# Altium schematic sheet FAT32.SchDoc
size A4
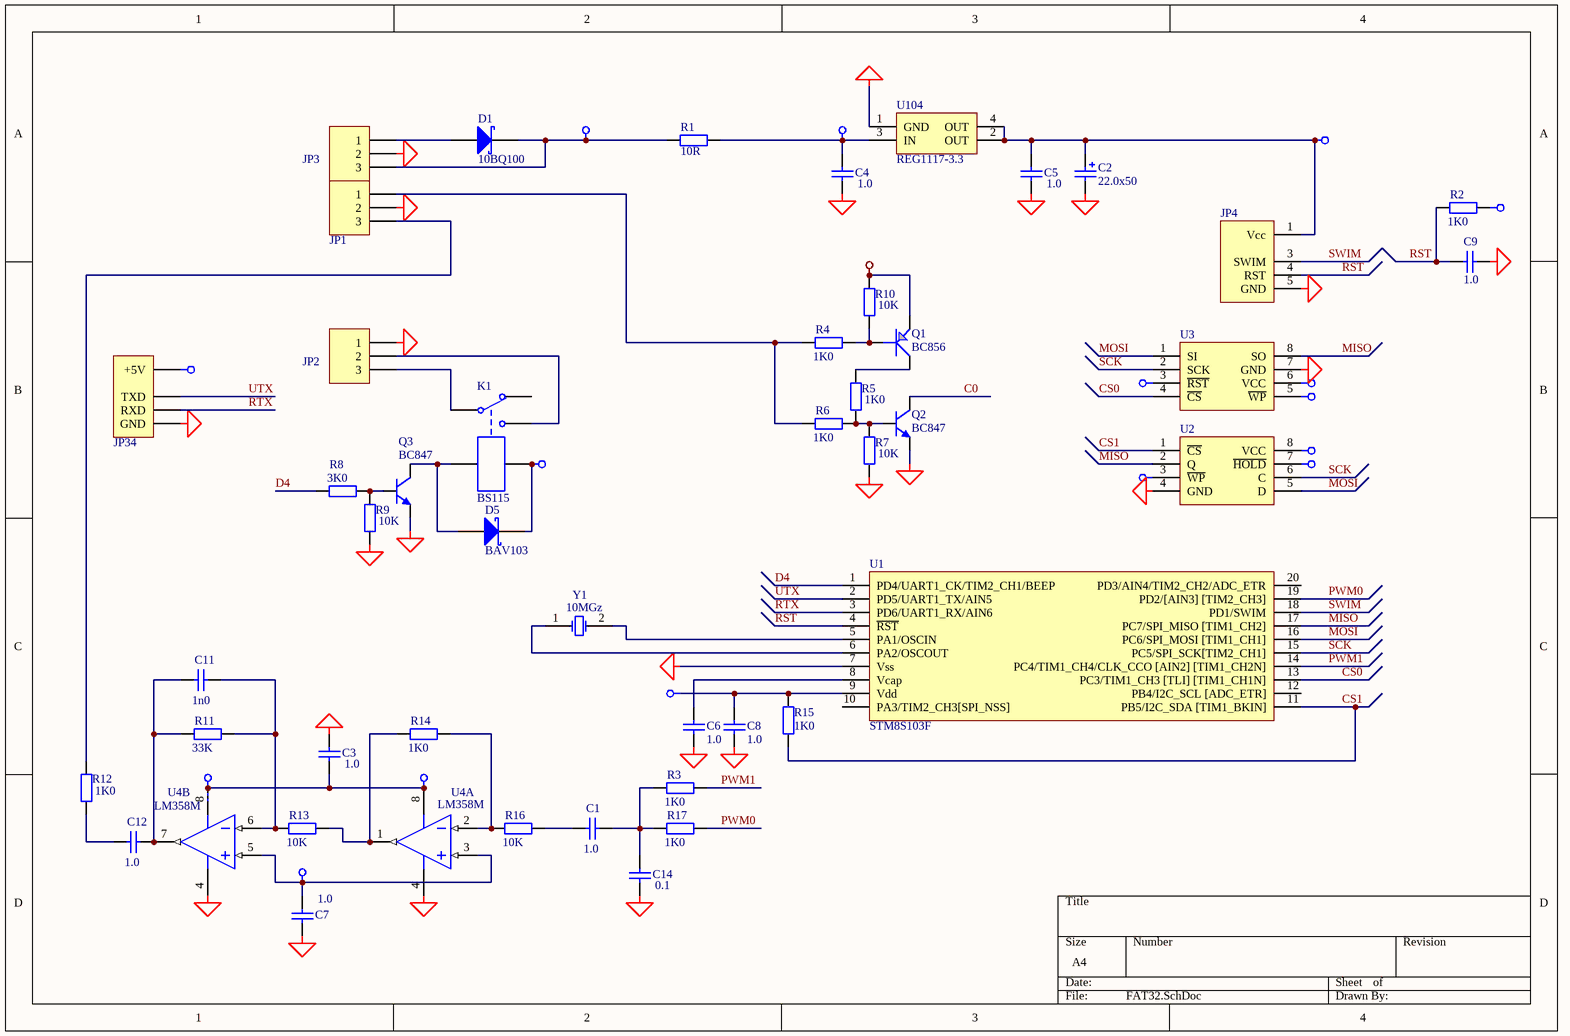
[diagram p0: FAT32.SchDoc]

## Parts
C1  1.0  [_1206]
C2  22.0x50  [CAP_EL_6_3]
C3  1.0  [_1206]
C4  1.0  [_1206]
C5  1.0  [_1206]
C6  1.0  [_1206]
C7  1.0  [_1206]
C8  1.0  [_1206]
C9  1.0  [_1206]
C11  1n0  [_1206]
C12  1.0  [_1206]
C14  0.1  [_1206]
D1  10BQ100  [DSO-C2/X2.3]
D5  BAV103  [_1206d]
JP1  Header 3  [BT5-3]  (value not drawn)
JP2  Header 3  [BT5-3]  (value not drawn)
JP3  Header 3  [BT5-3]  (value not drawn)
JP4  (no value)  [HDR1X5_uart]
JP34  UART_PORT  [HDR1X5_uart]  (value not drawn)
K1  BS115  [BS115]
Q1  BC856  [SO-G3]
Q2  BC847  [SO-G3/C2.5]
Q3  BC847  [SO-G3/C2.5]
R1  value 10R  [_1206]  (hidden comment: Res2)
R2  1K0  [_1206]
R3  1K0  [_1206]
R4  1K0  [_1206]
R5  1K0  [_1206]
R6  1K0  [_1206]
R7  10K  [_1206]
R8  3K0  [_1206]
R9  10K  [_1206]
R10  10K  [_1206]
R11  33K  [_1206]
R12  1K0  [_1206]
R13  10K  [_1206]
R14  1K0  [_1206]
R15  1K0  [_1206]
R16  10K  [_1206]
R17  1K0  [_1206]
U1  (no value)  [TSSO6x6-G20/Y1.6]
U2  (no value)  [SO-G8]
U3  (no value)  [AT45W]
U4  LM358M  [SO-G8]  (parts A,B of 2)
U104  REG1117-3.3  [SIP-G3/C7.4]
Y1  10MGz  [QWARZ1]

## Nets
+3v3: C2.1 C5.2 C7.2 C8.2 JP4.1(Vcc) JP34.1(+5V) R2.1 R15.2 U1.9(Vdd) U2.3(~{WP}) U2.7(~{HOLD}) U2.8(VCC) U3.3(~{RST}) U3.5(~{WP}) U3.6(VCC) U4.3(IN+) U4.5(IN+) U104.2(OUT) U104.4(OUT)
+12v: D1.2(K) D5.2(K) JP3.3 K1.5 Q1.2(E) R1.1 R10.2
+12vi: C3.2 C4.2 R1.2 U4.8(V+) U104.3(IN)
GND: C2.2 C3.1 C4.1 C5.1 C6.1 C7.1 C8.1 C9.1 C14.2 JP1.2 JP2.1 JP3.2 JP4.5(GND) JP34.5(GND) Q2.2(E) Q3.2(E) R7.2 R9.2 U1.7(Vss) U2.4(GND) U3.7(GND) U4.4(GND) U104.1(GND)
C0: Q2.3(C)
CS0: U1.13(PC3/TIM1_CH3_[TLI]_[TIM1_CH1N]) U3.4(~{CS})
CS1: R15.1 U1.11(PB5/I2C_SDA_[TIM1_BKIN]) U2.1(~{CS})
D4: R8.2 U1.1(PD4/UART1_CK/TIM2_CH1/BEEP)
MISO: U1.17(PC7/SPI_MISO_[TIM1_CH2]) U2.2(Q) U3.8(SO)
MOSI: U1.16(PC6/SPI_MOSI_[TIM1_CH1]) U2.5(D) U3.1(SI)
PWM0: R17.2 U1.19(PD2/[AIN3]_[TIM2_CH3])
PWM1: R3.2 U1.14(PC4/TIM1_CH4/CLK_CCO_[AIN2]_[TIM1_CH2N])
RST: C9.2 JP4.4(RST) R2.2 U1.4(~{RST})
RTX: JP34.4(RXD) U1.3(PD6/UART1_RX/AIN6)
SCK: U1.15(PC5/SPI_SCK[TIM2_CH1]) U2.6(C) U3.2(SCK)
SWIM: JP4.3(SWIM) U1.18(PD1/SWIM)
UTX: JP34.3(TXD) U1.2(PD5/UART1_TX/AIN5)
NetC1_1: C1.1 R16.2
NetC1_2: C1.2 C14.1 R3.1 R17.1
NetC6_2: C6.2 U1.8(Vcap)
NetC11_1: C11.1 C12.1 R11.1 U4.7(OUT)
NetC11_2: C11.2 R11.2 R13.1 U4.6(IN-)
NetC12_2: C12.2 R12.2
NetD1_1: D1.1(A) JP3.1
NetD5_1: D5.1(A) K1.4 Q3.3(C)
NetJP1_1: JP1.1 R4.2 R6.2
NetJP1_3: JP1.3 R12.1
NetJP2_2: JP2.2 K1.3
NetJP2_3: JP2.3 K1.1
NetQ1_1: Q1.1(B) R4.1 R10.1
NetQ1_3: Q1.3(C) R5.1
NetQ2_1: Q2.1(B) R5.2 R6.1 R7.1
NetQ3_1: Q3.1(B) R8.1 R9.1
NetR13_2: R13.2 R14.1 U4.1(OUT)
NetR14_2: R14.2 R16.1 U4.2(IN-)
NetU1_5: U1.5(PA1/OSCIN) Y1.2(OSC2)
NetU1_6: U1.6(PA2/OSCOUT) Y1.1(OSC1)

Not connected (* = marked no-connect by the designer): K1 2; U1 10(PA3/TIM2_CH3[SPI_NSS]) 12(PB4/I2C_SCL_[ADC_ETR]) 20(PD3/AIN4/TIM2_CH2/ADC_ETR)

## Library data of the parts
C1 C3-C9 C11 C12 C14 = Cap Semi: Capacitor (Semiconductor SIM Model); Manufacturer: Generic Components; Class I: Passive; Value: 0,1; Published: 8-Jun-2000; Revision: July-2002: Re-released for DXP Platform.; Publisher: Altium Limited; Class II: Capacitor
C2 = Cap Pol1: Polarized Capacitor (Radial); Manufacturer: Generic Components; Class I: Passive; Value: 22,0x50; Published: 8-Jun-2000; Revision: July-2002: Re-released for DXP Platform.; Publisher: Altium Limited; Class II: Capacitor
D1 D5 = 10BQ015: Schottky Rectifier; Manufacturer: International Rectifier; Revision 1: 10-July-2000: SIM Model Added.; Revision 2: July-2002: Re-released for DXP Platform.; Class I: Discrete; Class II: Rectifier - Schottky; Published: 8-Jun-2000; Datasheet: Latest Revision: PD-2.396A; Package Reference: DO-214AA; Publisher: Altium Limited
JP1-JP3 = Header 3: Header, 3-Pin; Manufacturer: Generic Components; Class I: Connector; Revision: July-2002: Re-released for DXP Platform.; Publisher: Altium Limited
JP4 = SWIM_CONN
JP34 = UART_PORT: Header, 5-Pin; Manufacturer: Generic Components; Class I: Connector; Revision: July-2002: Re-released for DXP Platform.; Publisher: Altium Limited
K1 = BS115: Single-Pole Dual-Throw Relay; Manufacturer: Generic Components; Class I: Electro-mechanical; Published: 24-Mar-1999; Revision: July-2002: Re-released for DXP Platform.; Publisher: Altium Limited; Class II: Relay
Q1 = GT109: Right: 20; Bottom: 20
Q2 Q3 = BC847ALT1: General Purpose Transistor NPN Silicon; Manufacturer: Motorola; Package Information: Latest Revision: 1997; Class I: Discrete; Class II: BJT - Low Power; Published: 29-Sep-2000; Revision: July-2002: Re-released for DXP Platform.; Datasheet: Latest Revision: 1997; Package Reference: 318-08; Publisher: Altium Limited
R1 R7 R9 = Res2: Resistor; Manufacturer: Generic Components; Class I: Passive; Published: 8-Jun-2000; Revision: July-2002: Re-released for DXP Platform.; Publisher: Altium Limited; Class II: Resistor
  R7 R9: Value: 10K
R2-R6 R8 R11-R17 = Res2: Resistor; Manufacturer: Generic Components; Class I: Passive; Value: 1K; Published: 8-Jun-2000; Revision: July-2002: Re-released for DXP Platform.; Publisher: Altium Limited; Class II: Resistor
R10 = RES: Resistor; Manufacturer: Generic Components; Class I: Passive; Value: 1K; Published: 8-Jun-2000; Revision: July-2002: Re-released for DXP Platform.; Publisher: Altium Limited; Class II: Resistor
U1 = STM8S103F
U2 = M25P10
U3 = AT45DB161D-SU
U4 = LM358M: Low-Power Dual Operational Amplifier; Manufacturer: National Semiconductor; Package Information: Latest Revision: Sep-1997; Published: 15-Apr-2002; Datasheet: Latest Revision: Sep-1999; Package Reference: M08A; Publisher: Altium Limited; Class I: Amplifier; Class II: Operational Amplifier
U104 = REG1117-3.3: 800mA and 1A Low Dropout Positive Regulator 2.85V, 3.3V, 5V, and Adjustable; Manufacturer: Burr-Brown; Package Information: Latest Revision: Rev. C; Class I: Power Management; Class II: Voltage Regulator; Published: 8-Jun-2000; Revision: July-2002: Re-released for DXP Platform.; Datasheet: Latest Revision: Sep-1997; Package Reference: ZZ311; Publisher: Altium Limited
Y1 = XTAL: Crystal Oscillator; Manufacturer: Generic Components; Published: 8-Jun-2000; Revision: July-2002: Re-released for DXP Platform.; Publisher: Altium Limited; Class I: Oscillator; Class II: Crystal Oscillator; Value: 10MGz